# EAGLE schematic lumiled_driver_ser (EAGLE 8.4.1)
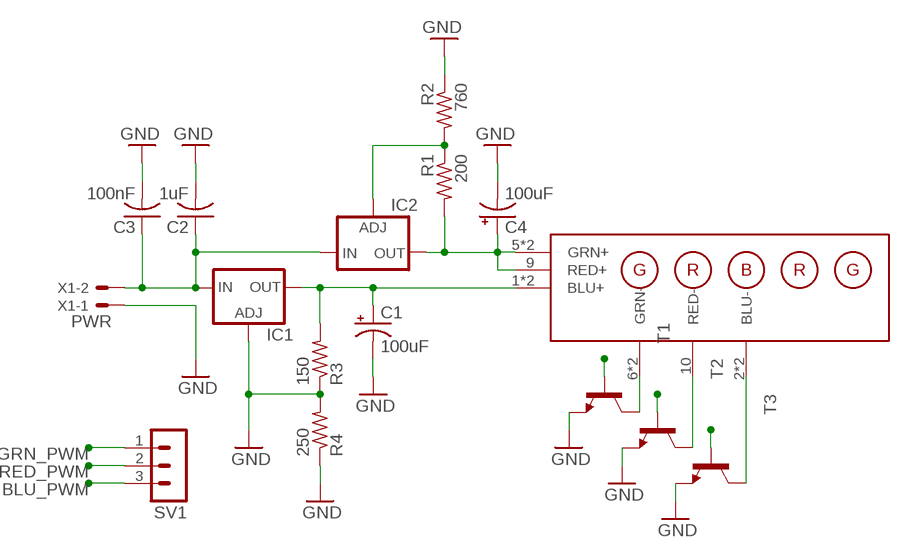
[diagram p0: schematic, sheet 1]

## Parts
C1  100uF  CPOL-USE2-5  [E2-5]
C2  1uF  C-US025-024X044  [C025-024X044]
C3  100nF  C-US025-024X044  [C025-024X044]
C4  100uF  CPOL-USE2-5  [E2-5]
IC1  LM317TL  [317TL]
IC2  LM317TL  [317TL]
R1  200  R-US_0309/12  [0309/12]
R2  760  R-US_0309/12  [0309/12]
R3  150  R-US_0309/12  [0309/12]
R4  250  R-US_0309/12  [0309/12]
SV1  MA03-1  [MA03-1]
T1  -NPN-TO92  [TO92]
T2  -NPN-TO92  [TO92]
T3  -NPN-TO92  [TO92]
U$1  LUMILED_5LED  [MA05-2]
X1  PWR  22-23-2021  [22-23-2021]

## Nets
+3.3V: C1.+ IC1.2(OUT) R3.2 U$1.1(BLU+) U$1.3(BLU+)
+VIN: C2.1 C3.1 IC1.3(IN) IC2.3(IN) X1.2
BLU_PWM: SV1.3 T3.2(B)
GND: C1.- C2.2 C3.2 C4.- IC1.1(ADJ) R2.1 R3.1 R4.1 R4.2 T1.1(E) T2.1(E) T3.1(E) X1.1
GRN_PWM: SV1.1 T1.2(B)
N$1: T1.3(C) U$1.6(GRN-) U$1.8(GRN-)
N$2: T2.3(C) U$1.10(RED-)
N$3: T3.3(C) U$1.2(BLU-) U$1.4(BLU-)
N$6: C4.+ IC2.2(OUT) R1.2 U$1.5(GRN+) U$1.7(GRN+) U$1.9(RED+)
N$7: IC2.1(ADJ) R1.1 R2.2
RED_PWM: SV1.2 T2.2(B)

## Library data of the parts
C1 C4 = rcl:CPOL-US: POLARIZED CAPACITOR, American symbol
C2 C3 = rcl:C-US: CAPACITOR, American symbol
IC1 IC2 = v-reg:LM317TL: VOLTAGE REGULATOR
R1-R4 = resistor:R-US_: RESISTOR, American symbol
SV1 = con-lstb:MA03-1: PIN HEADER; OC_FARNELL: unknown; OC_NEWARK: unknown
T1-T3 = transistor:*-NPN-: NPN Transistror BF959 corrected 2008.03.06
U$1 = lumiled_led:LUMILED_5LED
X1 = con-molex:22-23-2021: .100" (2.54mm) Center Header - 2 Pin; MF: MOLEX; MPN: 22-23-2021; OC_FARNELL: 1462926; OC_NEWARK: 25C3832